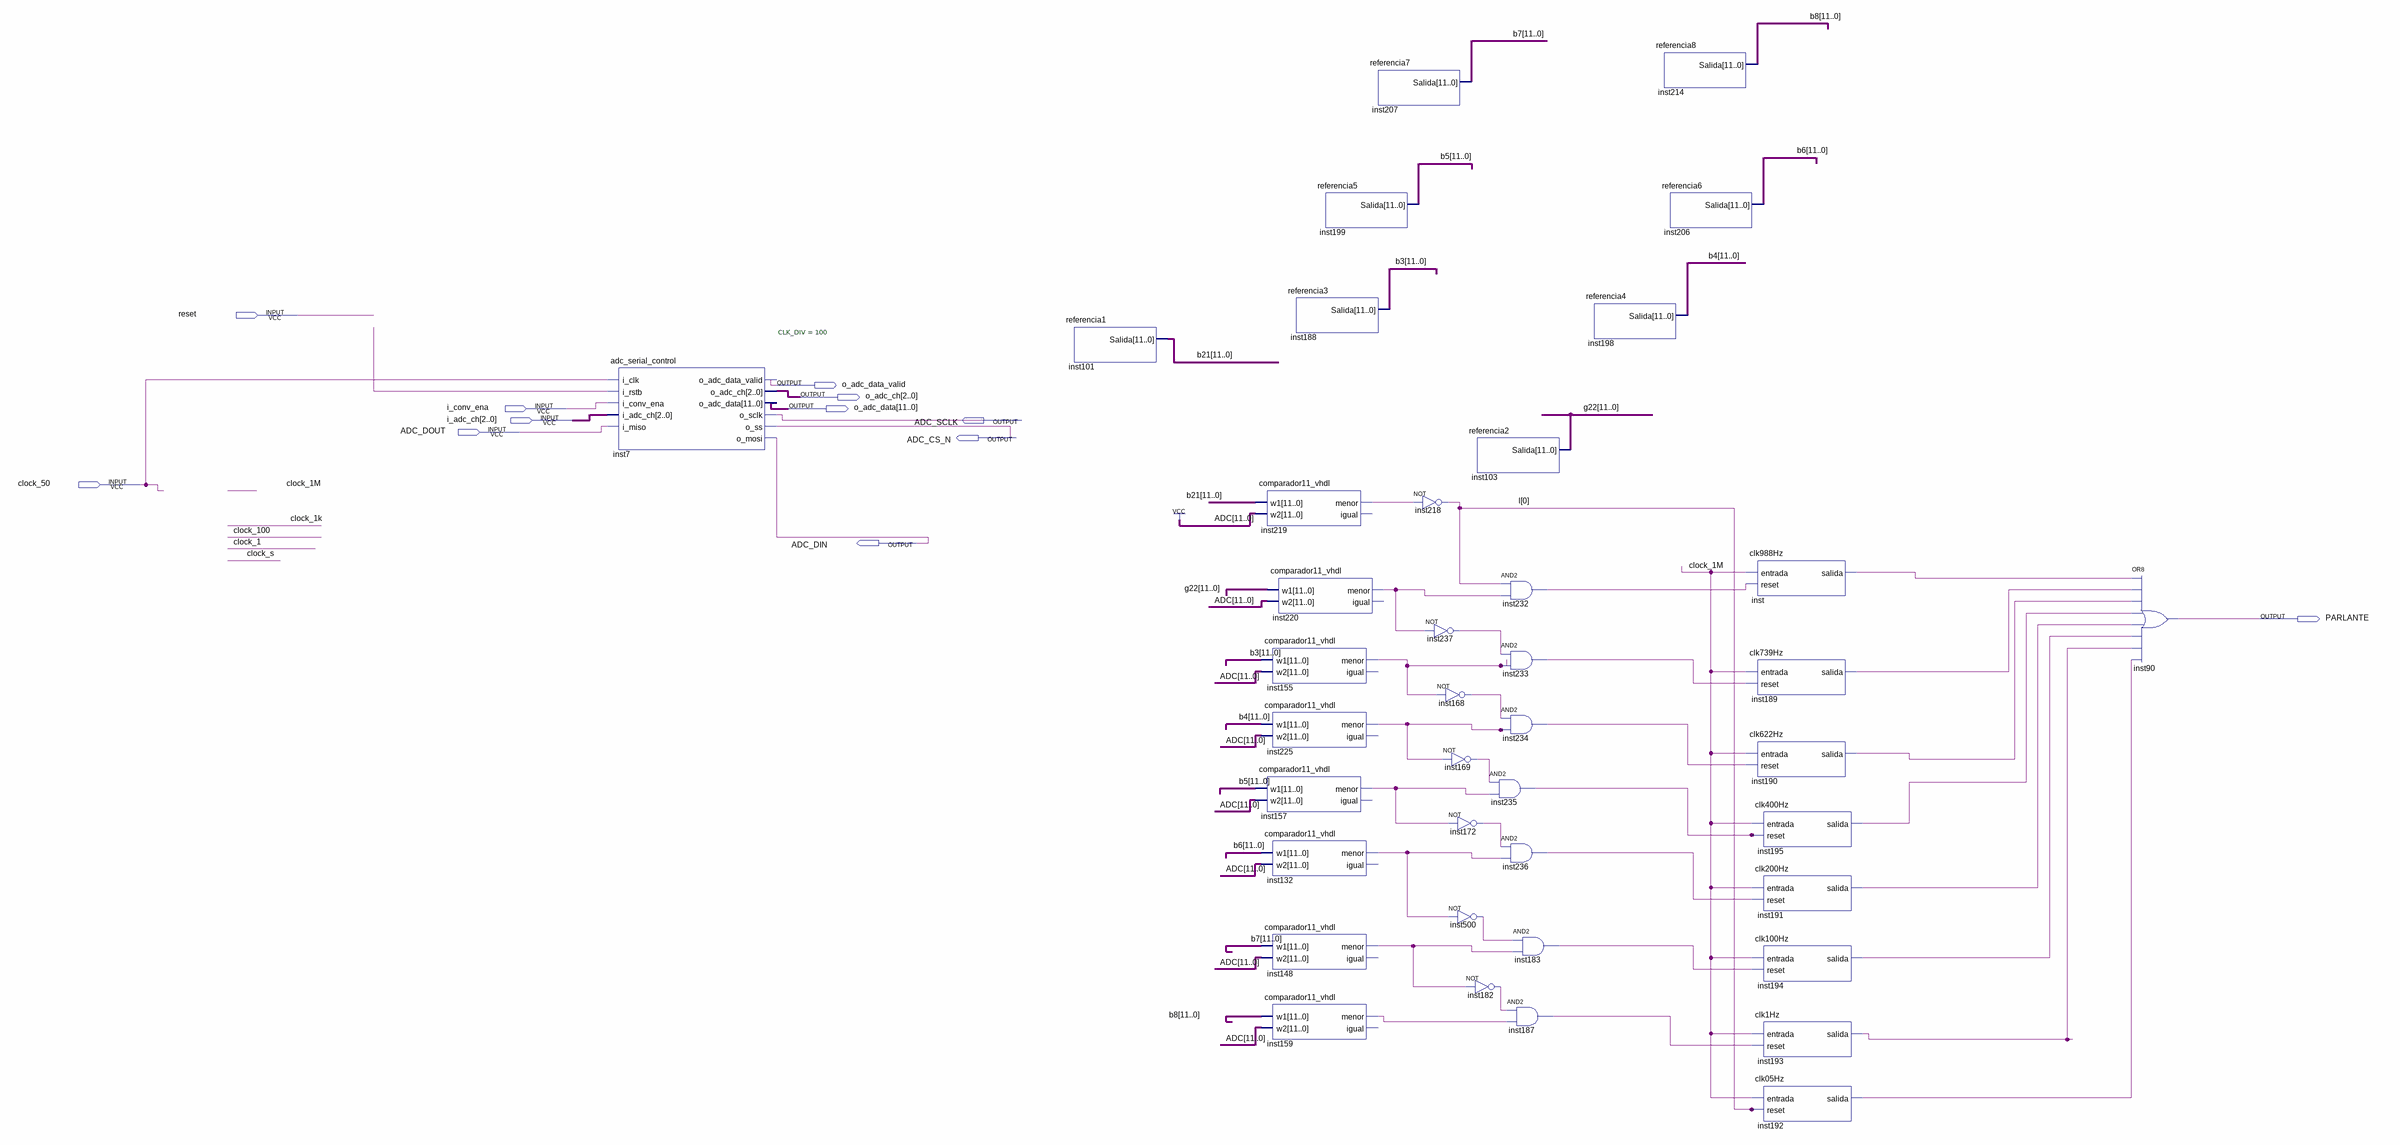
[diagram p0: schematic sheet]
// Quartus schematic prueba.bdf as structural Verilog: 40 symbols, 12 pins
module prueba (
  input  reset,
  input  i_conv_ena,
  input  [2:0] i_adc_ch,
  input  ADC_DOUT,
  input  clock_50,
  output o_adc_data_valid,
  output [2:0] o_adc_ch,
  output [11:0] o_adc_data,
  output ADC_SCLK,
  output ADC_CS_N,
  output ADC_DIN,
  output PARLANTE
);

  wire clock_1M, inst132_menor, inst148_menor, inst155_menor, inst157_menor, inst159_menor, inst168_out,
       inst169_out, inst172_out, inst182_out, inst183_out, inst187_out, inst189_salida, inst190_salida,
       inst191_salida, inst192_salida, inst193_salida, inst194_salida, inst195_salida, inst219_menor,
       inst220_menor, inst225_menor, inst232_out, inst233_out, inst234_out, inst235_out, inst236_out,
       inst237_out, inst500_out, inst_salida, undriven;
  wire [0:0] l;
  wire [11:0] b3, b4, b5, b6, b7, b8, b21, g22;

  adc_serial_control #(.CLK_DIV(100)) inst7 (
    .i_clk(clock_50), .i_rstb(undriven), .i_conv_ena(i_conv_ena), .i_adc_ch(i_adc_ch), .i_miso(ADC_DOUT),
    .o_adc_data_valid(o_adc_data_valid), .o_adc_ch(o_adc_ch), .o_adc_data(o_adc_data), .o_sclk(ADC_SCLK),
    .o_ss(ADC_CS_N), .o_mosi(ADC_DIN));
  referencia1 inst101 (.Salida(b21));
  referencia3 inst188 (.Salida(b3));
  comparador11_vhdl inst219 (.w1(b21), .w2({12{1'b1}}), .menor(inst219_menor));  // open: igual
  comparador11_vhdl inst220 (.w1(g22), .w2({12{1'b1}}), .menor(inst220_menor));  // open: igual
  comparador11_vhdl inst155 (.w1(b3), .w2({12{1'b1}}), .menor(inst155_menor));  // open: igual
  comparador11_vhdl inst225 (.w1(b4), .w2({12{1'b1}}), .menor(inst225_menor));  // open: igual
  comparador11_vhdl inst157 (.w1(b5), .w2({12{1'b1}}), .menor(inst157_menor));  // open: igual
  comparador11_vhdl inst132 (.w1(b6), .w2({12{1'b1}}), .menor(inst132_menor));  // open: igual
  comparador11_vhdl inst148 (.w1(b7), .w2({12{1'b1}}), .menor(inst148_menor));  // open: igual
  comparador11_vhdl inst159 (.w1(b8), .w2({12{1'b1}}), .menor(inst159_menor));  // open: igual
  referencia5 inst199 (.Salida(b5));
  referencia7 inst207 (.Salida(b7));
  not inst218 (l[0], inst219_menor);
  not inst237 (inst237_out, inst220_menor);
  referencia2 inst103 (.Salida(g22));
  not inst168 (inst168_out, inst155_menor);
  not inst169 (inst169_out, inst225_menor);
  not inst172 (inst172_out, inst157_menor);
  not inst500 (inst500_out, inst132_menor);
  not inst182 (inst182_out, inst148_menor);
  and inst232 (inst232_out, l[0], inst220_menor);
  and inst233 (inst233_out, inst237_out, inst155_menor);
  and inst234 (inst234_out, inst168_out, inst225_menor);
  and inst235 (inst235_out, inst169_out, inst157_menor);
  and inst236 (inst236_out, inst172_out, inst132_menor);
  and inst183 (inst183_out, inst500_out, inst148_menor);
  and inst187 (inst187_out, inst182_out, inst159_menor);
  referencia4 inst198 (.Salida(b4));
  referencia8 inst214 (.Salida(b8));
  referencia6 inst206 (.Salida(b6));
  clk988Hz inst (.entrada(clock_1M), .reset(inst232_out), .salida(inst_salida));
  clk739Hz inst189 (.entrada(clock_1M), .reset(inst233_out), .salida(inst189_salida));
  clk622Hz inst190 (.entrada(clock_1M), .reset(inst234_out), .salida(inst190_salida));
  clk400Hz inst195 (.entrada(clock_1M), .reset(inst235_out), .salida(inst195_salida));
  clk200Hz inst191 (.entrada(clock_1M), .reset(inst236_out), .salida(inst191_salida));
  clk100Hz inst194 (.entrada(clock_1M), .reset(inst183_out), .salida(inst194_salida));
  clk1Hz inst193 (.entrada(clock_1M), .reset(inst187_out), .salida(inst193_salida));
  clk05Hz inst192 (.entrada(clock_1M), .reset(l[0]), .salida(inst192_salida));
  or inst90 (PARLANTE, inst_salida, inst189_salida, inst190_salida, inst195_salida, inst191_salida, inst194_salida, inst193_salida, inst192_salida);
endmodule
